# Altium schematic sheet plc_module_xs.00001.001_DALI_Master.SchDoc: =GlobalProjectName
size 410 x 297 mm; ApprovedBy: Утвердил; CheckedBy: Проверил; Author: Разработал; SheetNumber: Лист; SheetTotal: Листов; PageSetup: Record=PageOptions|CenterHorizontal=True|CenterVertical=True|PrintScale=1.00|XCorrection=1.00|YCorrection=1.00|PrintKind=1|BorderSize=5000000|LeftOffset=0|BottomOffset=0|Orientation=2|PaperLength=1000|PaperWidth=1000|Scale=100|PaperSource=15|PrintQuality=1200|MediaType=1|DitherType=10|PaperKind=A3|PrintScaleMode=1; Weight: -; ScaleFactor: -; NormInspection: Норм.Контр.
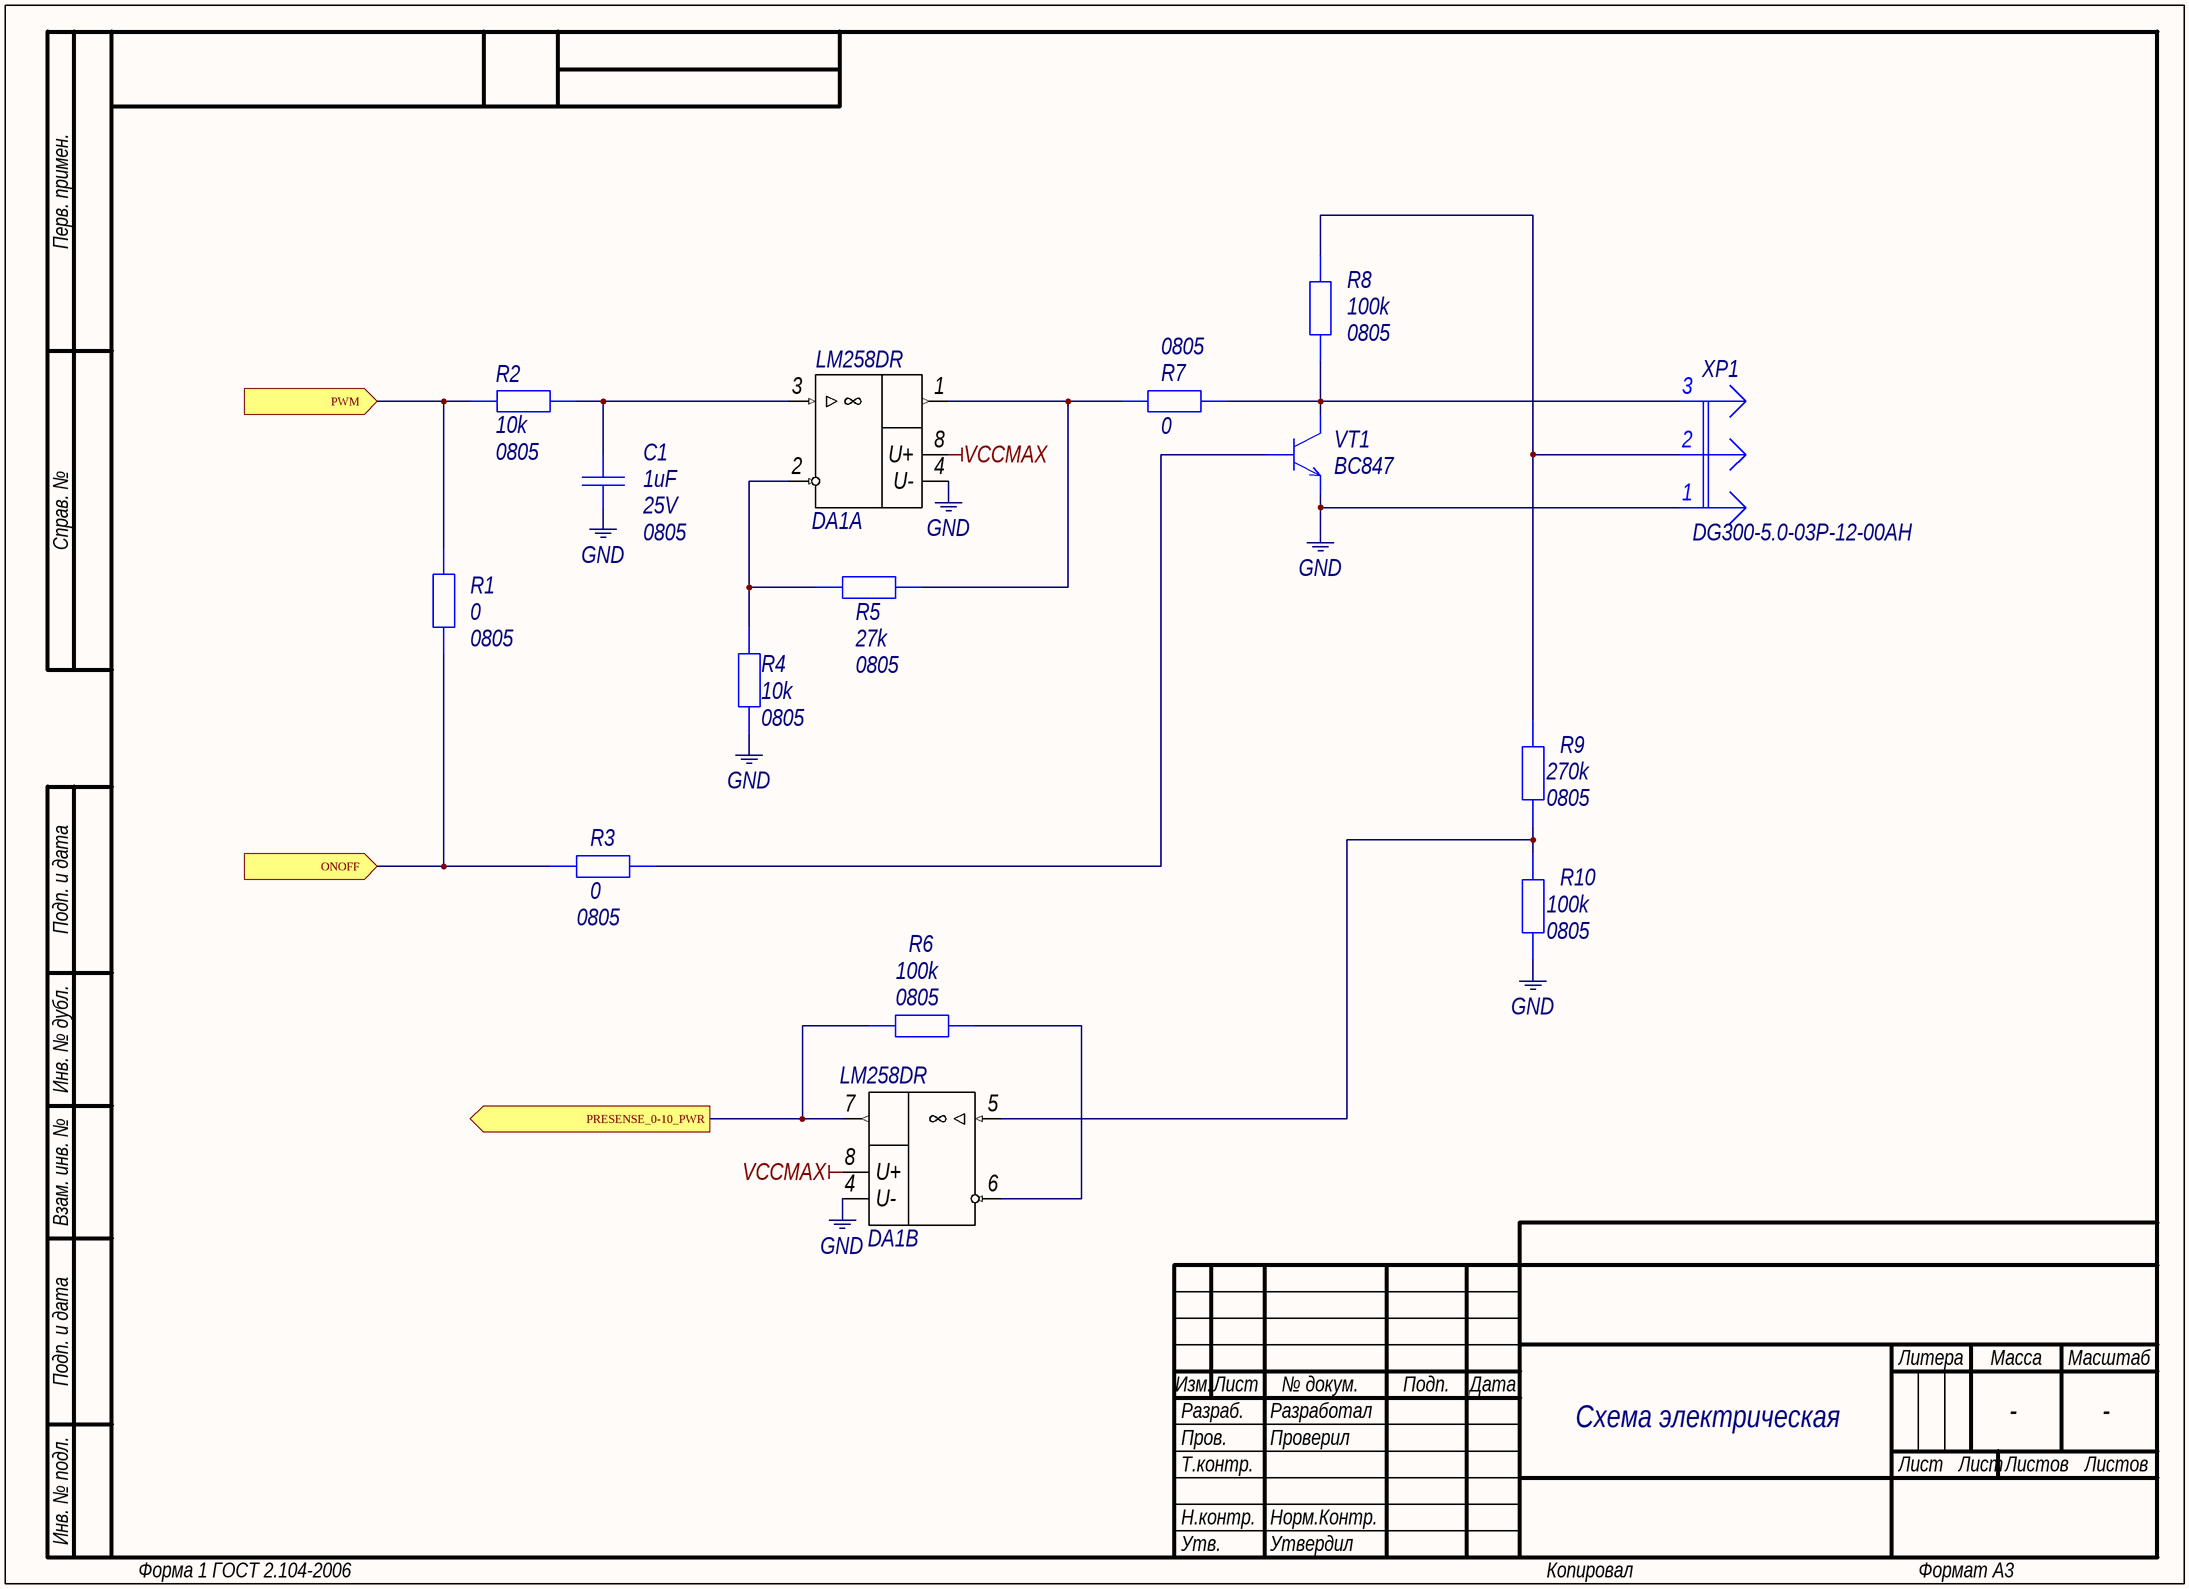
[diagram p0: plc_module_xs.00001.001_DALI_Master.SchDoc]

## Parts
C1  Voltage: 25V  Footprint: 0805  [C0805]  (hidden comment: 1uF)
DA1  LM258DR  [SOIC-8]  (parts A,B of 2)
R1  value 0  Footprint: 0805  [R0805]  (hidden comment: Resistor)
R2  Footprint: 0805  [R0805]  (hidden comment: 10k)
R3  value 0  Footprint: 0805  [R0805]  (hidden comment: Resistor)
R4  Footprint: 0805  [R0805]  (hidden comment: 10k)
R5  Footprint: 0805  [R0805]  (hidden comment: 27k)
R6  Footprint: 0805  [R0805]  (hidden comment: 100k)
R7  Footprint: 0805  [R0805]  (hidden comment: 0)
R8  Footprint: 0805  [R0805]  (hidden comment: 100k)
R9  Footprint: 0805  [R0805]  (hidden comment: 270k)
R10  Footprint: 0805  [R0805]  (hidden comment: 100k)
VT1  value BC847  [SOT-23]  (hidden comment: BJT-NPN)
XP1  value DG300-5.0-03P-12-00AH  [PHOENIX_1715734]  (hidden comment: GND PWR CTRL)

## Ports
ONOFF (in), PRESENSE_0-10_PWR (out), PWM (in)

## Nets
GND: C1.1 DA1.4(U-) R4.2 R10.1 VT1.3(Э) XP1.1
VCCMAX: DA1.8(U+)
ONOFF: R1.2 R3.1 ; port ONOFF
PRESENSE_0-10_PWR: DA1.7(OUT) R6.1 ; port PRESENSE_0-10_PWR
PWM: R1.1 R2.2 ; port PWM
NetC1_2: C1.2 DA1.3(IN+) R2.1
NetDA1_1: DA1.1(OUT) R5.2 R7.1
NetDA1_2: DA1.2(IN-) R4.1 R5.1
NetDA1_5: DA1.5(IN+) R9.1 R10.2
NetDA1_6: DA1.6(IN-) R6.2
NetR3_2: R3.2 VT1.1(Б)
NetR7_2: R7.2 R8.1 VT1.2(К) XP1.3
NetR8_2: R8.2 R9.2 XP1.2

## Notes on the sheet
- Схема электрическая
  принципиальная
- Перв. примен.
- Справ. №
- Подп. и дата
- Инв. № дубл.
- Взам. инв. №
- Разраб.
- Изм.
- Лист
- № докум.
- Подп.
- Дата
- Литера
- Масса
- Масштаб
- Пров.
- Т.контр.
- Листов
- Инв. № подл.
- Н.контр.
- Утв.
- Форма 1 ГОСТ 2.104-2006
- Копировал
- Формат А3

## Library data of the parts
C1 = GRM219R71E105KA88D: Manufacturer: Murata; Type: Конденсатор; ID: 229; Tolerance: ±10%; Dielectric Type: X7R; Application Category: 1; Working Temperature Min: -55°С; Working Temperature Max: +125°С; Published: 18.05.2010; Publisher: Andrew Danich; Part Number: GRM219R71E105KA88D; Value: 1uF
DA1 = LM258DR: ID: 65; Supply Operation: +3…32V; Supply Current: 1.2mA; Rail-to-Rail: -\-; Slew Rate: 0.3V/µs; Bandwidth: 0.7MHz; Published: 08.12.2013; Publisher: Andrew Danich; Type: Микросхема; Part Number: LM258DR; Value: LM258DR
R1 R3 = RC0805JR-070RL: Manufacturer: Yageo; ID: 421; Limit Voltage: 150V; Tolerance: ±5%; Temperature Coefficient: 100ppm; Total Power Dissipation: 0.125W; Series Type: Thick-Film; Application Category: 1; Working Temperature Min: -55°С; Working Temperature Max: +155°С; Published: 24.03.2010; Publisher: Andrew Danich; Type: Резистор; Part Number: RC0805JR-070RL
R2 R4 = RC0805JR-0710KL: Manufacturer: Yageo; ID: 99; Limit Voltage: 150V; Tolerance: ±5%; Temperature Coefficient: 100ppm; Total Power Dissipation: 0.125W; Series Type: Thick-Film; Application Category: 1; Working Temperature Min: -55°С; Working Temperature Max: +155°С; Published: 24.03.2010; Publisher: Andrew Danich; Type: Резистор; Part Number: RC0805JR-0710KL; Value: 10k
R5 = RC0805JR-0727KL: Manufacturer: Yageo; ID: 127; Limit Voltage: 150V; Tolerance: ±5%; Temperature Coefficient: 100ppm; Total Power Dissipation: 0.125W; Series Type: Thick-Film; Application Category: 1; Working Temperature Min: -55°С; Working Temperature Max: +155°С; Published: 24.03.2010; Publisher: Andrew Danich; Type: Резистор; Part Number: RC0805JR-0727KL; Value: 27k
R6 R8 R10 = RC0805JR-07100KL: Manufacturer: Yageo; ID: 98; Limit Voltage: 150V; Tolerance: ±5%; Temperature Coefficient: 100ppm; Total Power Dissipation: 0.125W; Series Type: Thick-Film; Application Category: 1; Working Temperature Min: -55°С; Working Temperature Max: +155°С; Published: 24.03.2010; Publisher: Andrew Danich; Type: Резистор; Part Number: RC0805JR-07100KL; Value: 100k
R7 = RC0805JR-0727RL: Part Number: RC0805JR-070RL; Manufacturer: Yageo; ID: 125; Limit Voltage: 150V; Tolerance: ±5%; Temperature Coefficient: 100ppm; Total Power Dissipation: 0.125W; Series Type: Thick-Film; Application Category: 1; Working Temperature Min: -55°С; Working Temperature Max: +155°С; Published: 24.03.2010; Publisher: Andrew Danich; Type: Резистор; Value: 0
R9 = RC0805JR-07270KL: Manufacturer: Yageo; ID: 126; Limit Voltage: 150V; Tolerance: ±5%; Temperature Coefficient: 100ppm; Total Power Dissipation: 0.125W; Series Type: Thick-Film; Application Category: 1; Working Temperature Min: -55°С; Working Temperature Max: +155°С; Published: 24.03.2010; Publisher: Andrew Danich; Type: Резистор; Part Number: RC0805JR-07270KL; Value: 270k
VT1 = BC847: Type: Транзистор; ID: 1; C-E Voltage: 45V; Collector Current: 100mA; C-E Saturation Voltage: 0.6V; DC Current Gain: 110…800; Total Power Dissipation: 250mW; Transition Frequency: 100MHz; Published: 07.05.2013; Publisher: Andrew Danich; Part Number: BC847
XP1 = DG300-5.0-03P-12-00AH: ID: 97; Limit Voltage: 300V; Limit Current: 10A; Connector Type: Female; Resistance: 20mohm; Pitch: 5mm; Working Temperature Min: -40°С; Working Temperature Max: +105°С; URL1: <div><a href="https://www.terraelectronica.ru/product/988120">https://www.terraelectronica.ru/product/988120</a></div>; Published: 07.03.2013; Publisher: Andrew Danich; Type: Вилка; Part Number: DG300-5.0-03P-12-00AH; Pins: 3; Distributor1: terraelectronica